# Altium schematic sheet Diagnostics.SchDoc: Diagnostics
size A3; Author: M.Beldyga; CompanyName: WUT ISE; DrawnBy: M.Beldyga; Organization: WUT ISE; Address1: PW ISE; Address2: Nowowiejska 15/19 00-665 Warsaw; Address3: micbeldyga@gmail.com; SheetNumber: 8; SheetTotal: 9; ModifiedBy: -; CheckedDate: -; Title2: xxx; DivGrp: WUT ISE; Designer: GK, MB; ModifiedDate: -; ProjectName: Sensor Box
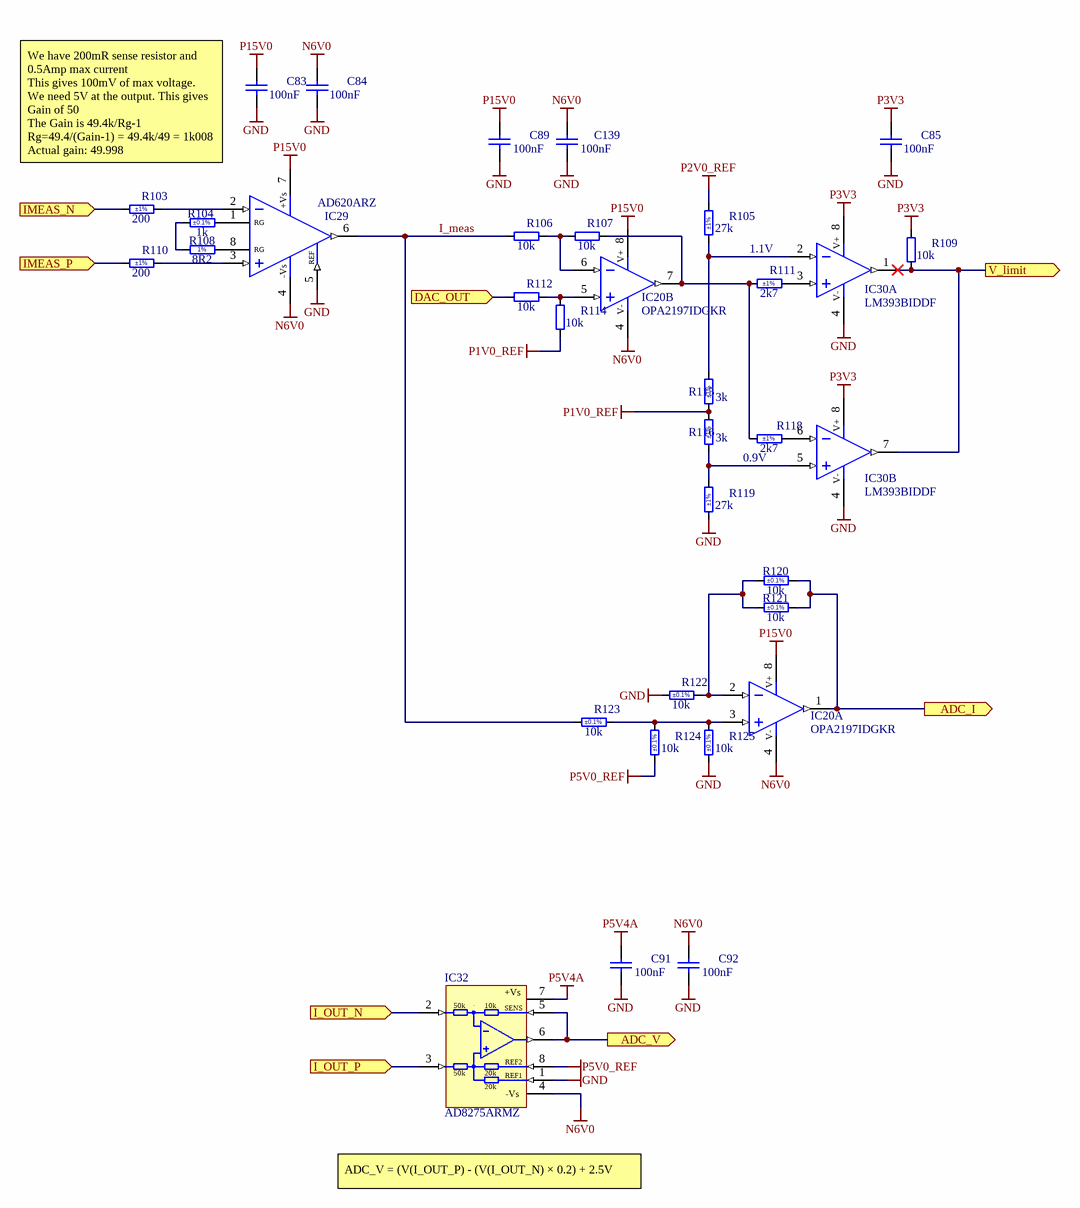
[diagram p0: Diagnostics.SchDoc]

## Parts
C83  100nF  [CAPC1005X55N]
C84  100nF  [CAPC1005X55N]
C85  100nF  [CAPC1005X55N]
C89  100nF  [CAPC1005X55N]
C91  100nF  [CAPC1005X55N]
C92  100nF  [CAPC1005X55N]
C139  100nF  [CAPC1005X55N]
IC20  OPA2197IDGKR  [SOP65P490X110-8N]  (parts A,B of 2)
IC29  AD620ARZ  [SOIC127P600X175-8N]
IC30  LM393BIDDF  [SOT65P280X110-8N]  (parts A,B of 2)
IC32  AD8275ARMZ  [SOP65P490X110-8N]
R103  200  Tolerance: ±1%  [RESC1608X55N]
R104  1k  Tolerance: ±0.1%  [RESC1005X40N]
R105  27k  Tolerance: ±1%  [RESC1005X40N]
R106  10k  [RESC1005X35N]
R107  10k  [RESC1005X35N]
R108  8R2  [RESC1608X55N]
R109  10k  [RESC1005X35N]
R110  200  Tolerance: ±1%  [RESC1608X55N]
R111  2k7  Tolerance: ±1%  [RESC1005X40N]
R112  10k  [RESC1005X35N]
R114  10k  [RESC1005X35N]
R115  3k  Tolerance: ±1%  [RESC1005X40N]
R116  3k  Tolerance: ±1%  [RESC1005X40N]
R118  2k7  Tolerance: ±1%  [RESC1005X40N]
R119  27k  Tolerance: ±1%  [RESC1005X40N]
R120  10k  Tolerance: ±0.1%  [RESC1005X35N]
R121  10k  Tolerance: ±0.1%  [RESC1005X35N]
R122  10k  Tolerance: ±0.1%  [RESC1005X35N]
R123  10k  Tolerance: ±0.1%  [RESC1005X35N]
R124  10k  Tolerance: ±0.1%  [RESC1005X35N]
R125  10k  Tolerance: ±0.1%  [RESC1005X35N]

## Ports
ADC_I (out), ADC_V (out), DAC_OUT (in), I_OUT_N (in), I_OUT_P (in), IMEAS_N (in), IMEAS_P (in), V_limit (out)

## Nets
GND: C83.1 C84.1 C85.1 C89.1 C91.1 C92.1 C139.1 IC29.5(REF) IC30.4(V-) IC32.1(REF1) R119.1 R122.1 R125.1
N6V0: C84.2 C92.2 C139.2 IC20.4(V-) IC29.4(-Vs) IC32.4(-Vs)
P1V0_REF: R114.1 R115.1 R116.2
P2V0_REF: R105.2
P3V3: C85.2 IC30.8(V+) R109.2
P5V0_REF: IC32.8(REF2) R124.1
P5V4A: C91.2 IC32.7(+Vs)
P15V0: C83.2 C89.2 IC20.8(V+) IC29.7(+Vs)
ADC_I: IC20.1(OUT) R120.2 R121.2 ; port ADC_I
ADC_V: IC32.5(SENSE) IC32.6(OUT) ; port ADC_V
DAC_OUT: R112.1 ; port DAC_OUT
I_meas: IC29.6(Vout) R106.1 R123.1
I_OUT_N: IC32.2(IN-) ; port I_OUT_N
I_OUT_P: IC32.3(IN+) ; port I_OUT_P
IMEAS_N: R103.1 ; port IMEAS_N
IMEAS_P: R110.1 ; port IMEAS_P
V_limit: IC30.1(OUT) IC30.7(OUT) R109.1 ; port V_limit
NetIC20_2: IC20.2(IN-) R120.1 R121.1 R122.2
NetIC20_3: IC20.3(IN+) R123.2 R124.2 R125.2
NetIC20_5: IC20.5(IN+) R112.2 R114.2
NetIC20_6: IC20.6(IN-) R106.2 R107.1
NetIC20_7: IC20.7(OUT) R107.2 R111.1 R118.1
NetIC29_1: IC29.1(-RG) R104.2
NetIC29_2: IC29.2(-IN) R103.2
NetIC29_3: IC29.3(+IN) R110.2
NetIC29_8: IC29.8(+RG) R108.2
NetIC30_2: IC30.2(IN-) R105.1 R115.2
NetIC30_3: IC30.3(IN+) R111.2
NetIC30_5: IC30.5(IN+) R116.1 R119.2
NetIC30_6: IC30.6(IN-) R118.2
NetR104_1: R104.1 R108.1

## Notes on the sheet
- We have 200mR sense resistor and 0.5Amp max current
  This gives 100mV of max voltage.
  We need 5V at the output. This gives Gain of 50
  The Gain is 49.4k/Rg-1
  Rg=49.4/(Gain-1) = 49.4k/49 = 1k008
  Actual gain: 49.998
- 1.1V
- (near R118) 0.9V
- ADC_V = (V(I_OUT_P) - (V(I_OUT_N) × 0.2) + 2.5V
- Project/Equipment
- Document
- Designer
- Drawn by
- Check.by
- Contact
- File
- Last Mod.
- Print Date
- Sheet
- Size
- A3
- of
- Rev
- (in symbol AD620ARZ) RG
- (in symbol AD8275ARMZ) 50k; 10k; SENS; 20k
- (in symbol R0603_8R2_1%_0.1W_200PPM) 1%

## Library data of the parts
C83-C85 C89 C91 C92 C139 = CC0402_100NF_16V_10%_X5R: Non-polarised capacitor; Part Description: SMD Multilayer Chip Ceramic Capacitor; Manufacturer: GENERIC; Manufacturer1 Part Number: GRM155R61C104KA88D; Voltage: 16V; TC: X5R; Tolerance: ±10%; Part Number: CC0402_100NF_16V_10%_X5R; Component Kind: Standard; Component Type: Standard; Pin Count: 2; Value: 100nF; Status: None; Manufacturer Part Number: CC0402_100NF_16V_10%_X5R; Case: 0402; Mounted: Yes; Socket: No; SMD: Yes; Sense: No; Manufacturer1 Example: MURATA; Manufacturer1 ComponentHeight: 0.55mm; HelpURL: \\cern.ch\dfs\Applications\Altium\Datasheets\CC0402_X5R_MURATA_GRM.pdf; Author: CERN DEM JLC; CreateDate: 10.12.2013; LatestRevisionDate: 10.12.2013
IC20 = OA_OPA2197IDGKR: 36-V, Precision, Rail-to-Rail Input Output, Low Offset Voltage Op Amp 8-VSSOP; Part Description: High-Precision, Low-Noise, Rail-to-Rail Output,10-MHz Op Amp; Manufacturer1: TEXAS INSTRUMENTS; PressFit: No; Bonding: No; Part Number: OPA2197IDGKR; Component Kind: Standard; Component Type: Standard; Device: OPA2197IDGKR; PackageDescription: SOP, 0.65mm pitch; 8 pin, 3.00mm W X 3.00mm L X 1.10mm H body, IPC Medium Density; Manufacturer1 Part Number: OPA2197IDGKR; Pin Count: 8; Case: MSOP8; Mounted: Yes; Socket: No; SMD: Yes; Sense: No; ComponentHeight: 1.1mm; Author: GK; HelpURL: \\cern.ch\dfs\Applications\Altium\Datasheets\OPA2140AIDGK.pdf; CreateDate: 20.04.2017; LatestRevisionDate: 20.04.2017
IC29 = AD620ARZ: Low Cost Low Power Instrumentation Amplifier; Manufacturer1: ANALOG DEVICES; Manufacturer1 Part Number: AD620ARZ-REEL7; PressFit: No; Bonding: No; Part Number: AD620ARZ; Component Kind: Standard; Component Type: Standard; Device: AD620ARZ; PackageDescription: SOIC 8, Pitch 1.27mm - Body 4x5mm, IPC Medium Density; Part Description: Low Cost Low Power Instrumentation Amplifier; Pin Count: 8; Case: SOIC8; Mounted: Yes; Socket: No; SMD: Yes; Sense: No; ComponentHeight: 1.75mm; Author: CERN DEM JLC; HelpURL: \\cern.ch\dfs\Applications\Altium\Datasheets\AD620ARZ.pdf; CreateDate: 13.02.2017; LatestRevisionDate: 29.03.2022
IC30 = LM393BIDDF: Dual Operational Amplifier; Part Description: Dual Commercial Grade Standard Comparator; Manufacturer: TEXAS INSTRUMENTS; PressFit: No; Bonding: No; Part Number: LM393BIDDF; Component Kind: Standard; Component Type: Standard; Device: LM393BIDDF; PackageDescription: SOT, 0.65mm pitch; 8 Pin, 1.625mm W X 2.90mm L X 1.10mm H body, IPC Medium Density; Manufacturer Part Number: LM393BIDDF; Pin Count: 8; Case: SOT23-8; Mounted: Yes; Socket: No; SMD: Yes; Sense: No; ComponentHeight: 1.1mm; Author: CERN DEM HF; HelpURL: \\cern.ch\dfs\Applications\Altium\Datasheets\LM393B.pdf; CreateDate: 3/17/2023; LatestRevisionDate: 3/17/2023
IC32 = AD8275ARMZ: G = 0.2, Level Translation, 16-Bit ADC Driver; Manufacturer: ANALOG DEVICES; PressFit: No; Bonding: No; Part Number: AD8275ARMZ; Component Kind: Standard; Component Type: Standard; Device: AD8275ARMZ; PackageDescription: SOP, 0.65mm Pitch; 8 Pin, 3.00mm W X 3.00mm L X 1.10mm H body, IPC Medium Density; Part Description: G = 0.2, Level Translation, 16-Bit ADC Driver; Manufacturer Part Number: AD8275ARM; Pin Count: 8; Case: MSOP8; Mounted: Yes; Socket: No; SMD: Yes; Sense: No; ComponentHeight: 1.1mm; Author: CERN DEM JLC; HelpURL: \\cern.ch\dfs\Applications\Altium\Datasheets\AD8275ARMZ.pdf; CreateDate: 10/29/2012; LatestRevisionDate: 3/29/2022
R103 R110 = R0603_200R_1%_0.1W_100PPM: Resistor - 1%; Part Description: General Purpose Thick Film Chip Resistor; Manufacturer: GENERIC; Manufacturer1: Vishay; Manufacturer1 Part Number: CRCW0603200RFKEA; Power: 0.1W; TC: ±100ppm/°C; PressFit: No; Part Number: R0603_200R_1%_0.1W_100PPM; Component Kind: Standard; Component Type: Standard; Pin Count: 2; Value: 200; Status: Preferred; Manufacturer Part Number: R0603_200R_1%_0.1W_100PPM; Case: 0603; Mounted: Yes; Sense: No; Socket: No; SMD: Yes; Manufacturer1 ComponentHeight: 0.55mm; HelpURL: \\cern.ch\dfs\Applications\Altium\Datasheets\R0603_NIC_NRC.pdf; Author: CERN DEM JLC; CreateDate: 03.12.2007; LatestRevisionDate: 13.03.2008
R104 = R0402_1K_0.1%_0.063W_25PPM: Resistor - 0.1%; Part Description: Thin Film Precision Resistor; Manufacturer: GENERIC; Manufacturer1 Part Number: ERA2AEB102X; Power: 0.063W; TC: ±25ppm/°C; PressFit: No; Voltage: 50V; Part Number: R0402_1K_0.1%_0.063W_25PPM; Component Kind: Standard; Component Type: Standard; Pin Count: 2; Value: 1k; Status: Not Recommended; Manufacturer Part Number: R0402_1K_0.1%_0.063W_25PPM; Case: 0402; Mounted: Yes; Sense: No; Socket: No; SMD: Yes; Manufacturer1 ComponentHeight: 0.4mm; HelpURL: \\cern.ch\dfs\Applications\Altium\Datasheets\R0402_PANASONIC_ERA.pdf; Author: CERN DEM BC; CreateDate: 7/10/2020; LatestRevisionDate: 7/10/2020; Manufacturer1 Example: PANASONIC
R105 R119 = R0402_27K_1%_0.0625W_100PPM: Resistor - 1%; Part Description: General Purpose Thick Film Chip Resistor; Manufacturer: GENERIC; Manufacturer1 Part Number: 232270672703L; TC: ±100ppm/°C; PressFit: No; Part Number: R0402_27K_1%_0.0625W_100PPM; Component Kind: Standard; Component Type: Standard; Pin Count: 2; Value: 27k; Status: Not Recommended; Power: 0.0625W; Manufacturer Part Number: R0402_27K_1%_0.0625W_100PPM; Case: 0402; Mounted: Yes; Sense: No; Socket: No; SMD: Yes; Manufacturer1 ComponentHeight: 0.4mm; HelpURL: \\cern.ch\dfs\Applications\Altium\Datasheets\R0402_Phycomp_RC0402.pdf; Author: CERN DEM JLC; CreateDate: 12/3/2007; LatestRevisionDate: 10/17/2012; Manufacturer1 Example: YAGEO PHYCOMP
R106 R107 R109 R112 R114 R120-R125 = R0402_10K_0.1%_0.063W_25PPM: Resistor - 0.1%; Part Description: Thin Film Precision Resistor; Manufacturer: GENERIC; Manufacturer1 Part Number: CPF0402B10KE1; Power: 0.063W; TC: ±25ppm/°C; PressFit: No; Part Number: R0402_10K_0.1%_0.063W_25PPM; Component Kind: Standard; Component Type: Standard; Pin Count: 2; Value: 10k; Status: Not Recommended; Manufacturer Part Number: R0402_10K_0.1%_0.063W_25PPM; Case: 0402; Mounted: Yes; Sense: No; Socket: No; SMD: Yes; Manufacturer1 ComponentHeight: 0.35mm; HelpURL: \\cern.ch\dfs\Applications\Altium\Datasheets\R0402_TYCO_CPF.pdf; Author: CERN DEM JMW; CreateDate: 9/22/2015; LatestRevisionDate: 9/22/2015; Manufacturer1 Example: TE CONNECTIVITY
  R106 R107 R109 R112 R114: Tolerance: ±0.1%
R108 = R0603_8R2_1%_0.1W_200PPM: Resistor - 1%; Part Description: General Purpose Thick Film Chip Resistor; Manufacturer: GENERIC; Manufacturer1: YAGEO PHYCOMP; Manufacturer1 Part Number: RC0603FR-078R2L; Power: 0.1W; TC: ±200ppm/°C; PressFit: No; Part Number: R0603_8R2_1%_0.1W_200PPM; Component Kind: Standard; Component Type: Standard; Pin Count: 2; Value: 8R2; Status: Preferred; Tolerance: ±1%; Manufacturer Part Number: R0603_8R2_1%_0.1W_200PPM; Case: 0603; Mounted: Yes; Sense: No; Socket: No; SMD: Yes; Manufacturer1 ComponentHeight: 0.65mm; HelpURL: \\cern.ch\dfs\Applications\Altium\Datasheets\R0603_Phycomp_RC0603.pdf; Author: CERN DEM JLC; CreateDate: 03/12/2007; LatestRevisionDate: 17/10/2012
R111 R118 = R0402_2K7_1%_0.0625W_100PPM: Resistor - 1%; Part Description: General Purpose Thick Film Chip Resistor; Manufacturer: GENERIC; Manufacturer1 Part Number: RC0402FR-072K7L; TC: ±200ppm/°C; PressFit: No; Part Number: R0402_2K7_1%_0.0625W_100PPM; Component Kind: Standard; Component Type: Standard; Pin Count: 2; Value: 2k7; Status: Not Recommended; Power: 0.0625W; Manufacturer Part Number: R0402_2K7_1%_0.0625W_100PPM; Case: 0402; Mounted: Yes; Sense: No; Socket: No; SMD: Yes; Manufacturer1 ComponentHeight: 0.4mm; HelpURL: \\cern.ch\dfs\Applications\Altium\Datasheets\R0402_YAGEO_RC_L.pdf; Author: CERN DEM HF; CreateDate: 8/28/2024; LatestRevisionDate: 8/28/2024; Manufacturer1 Example: YAGEO PHYCOMP
R115 R116 = R0402_3K_1%_0.0625W_100PPM: Resistor - 1%; Part Description: General Purpose Thick Film Chip Resistor; Manufacturer: GENERIC; Manufacturer1: Vishay; Manufacturer1 Part Number: RCS04023K00FKED; TC: ±100ppm/°C; PressFit: No; Part Number: R0402_3K_1%_0.0625W_100PPM; Component Kind: Standard; Component Type: Standard; Pin Count: 2; Value: 3k; Status: Not Recommended; Power: 0.0625W; Manufacturer Part Number: R0402_3K_1%_0.0625W_100PPM; Case: 0402; Mounted: Yes; Sense: No; Socket: No; SMD: Yes; Manufacturer1 ComponentHeight: 0.4mm; HelpURL: \\cern.ch\dfs\Applications\Altium\Datasheets\R0402_Phycomp_RC0402.pdf; Author: CERN DEM JLC; CreateDate: 03.12.2007; LatestRevisionDate: 17.10.2012